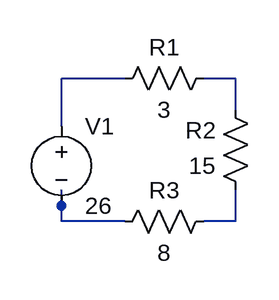
[diagram p0: schematic Draft1.asc]
Draft1.asc, the LTspice schematic file:
Version 4
SHEET 1 880 680
WIRE 32 -16 -32 -16
WIRE 144 -16 112 -16
WIRE 144 16 144 -16
WIRE -32 32 -32 -16
WIRE -32 112 -32 96
WIRE -32 128 -32 112
WIRE 32 128 -32 128
WIRE 144 128 144 96
WIRE 144 128 112 128
SYMBOL res 128 -32 R90
WINDOW 0 0 56 VBottom 2
WINDOW 3 32 56 VTop 2
SYMATTR InstName R1
SYMATTR Value 3
SYMBOL res 160 112 R180
WINDOW 0 36 76 Left 2
WINDOW 3 36 40 Left 2
SYMATTR InstName R2
SYMATTR Value 15
SYMBOL res 16 144 R270
WINDOW 0 32 56 VTop 2
WINDOW 3 0 56 VBottom 2
SYMATTR InstName R3
SYMATTR Value 8
SYMBOL voltage -32 16 R0
WINDOW 123 0 0 Left 0
WINDOW 39 0 0 Left 0
SYMATTR InstName V1
SYMATTR Value 26

The netlist it stands for:
* Draft1.asc
R1 N002 N001 3
R2 N004 N002 15
R3 N003 N004 8
V1 N001 N003 26
.backanno
.end